# Altium schematic sheet [01] - Shaper Stages.SchDoc
size A4; Address1: III. Physikalisches Institut B; Address2: RWTH Aachen University; Address3: Otto-Blumenthal-Strasse; Address4: 52074 Aachen, GERMANY; DocumentNumber: 2; SheetNumber: 2; SheetTotal: 6
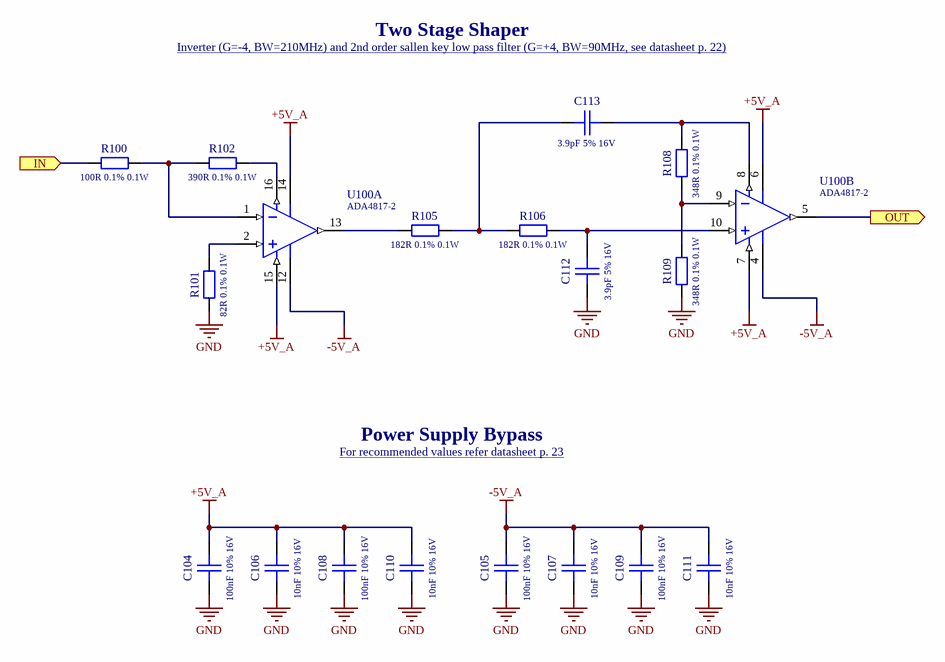
[diagram p0: [01] - Shaper Stages.SchDoc]

## Parts
C104  100nF 10% 16V  [0603_CAP]
C105  100nF 10% 16V  [0603_CAP]
C106  10nF 10% 16V  [0603_CAP]
C107  10nF 10% 16V  [0603_CAP]
C108  100nF 10% 16V  [0603_CAP]
C109  100nF 10% 16V  [0603_CAP]
C110  10nF 10% 16V  [0603_CAP]
C111  10nF 10% 16V  [0603_CAP]
C112  3.9pF 5% 16V  [0603_CAP]
C113  3.9pF 5% 16V  [0603_CAP]
R100  100R 0.1% 0.1W  [0603_RES]
R101  82R 0.1% 0.1W  [0603_RES]
R102  390R 0.1% 0.1W  [0603_RES]
R105  182R 0.1% 0.1W  [0603_RES]
R106  182R 0.1% 0.1W  [0603_RES]
R108  348R 0.1% 0.1W  [0603_RES]
R109  348R 0.1% 0.1W  [0603_RES]
U100  ADA4817-2  [LFCSP-16]  (parts A,B of 2)

## Ports
IN (in), OUT (out)

## Nets
+5V_A: C104.2 C106.2 C108.2 C110.2 U100.6(#VS2) U100.7(~{PD2}) U100.14(VS+) U100.15(~{PD})
-5V_A: C105.2 C107.2 C109.2 C111.2 U100.4(-VS2) U100.12(-VS1)
GND: C104.1 C105.1 C106.1 C107.1 C108.1 C109.1 C110.1 C111.1 C112.1 R101.2 R109.2
IN: R100.2 ; port IN
OUT: U100.5(OUT2) ; port OUT
NetC112_2: C112.2 R106.1 U100.10(IN2+)
NetC113_1: C113.1 R105.1 R106.2
NetC113_2: C113.2 R108.1 U100.8(FB2)
NetR100_1: R100.1 R102.2 U100.1(IN1-)
NetR101_1: R101.1 U100.2(IN2+)
NetR102_1: R102.1 U100.16(FB1)
NetR105_2: R105.2 U100.13(OUT1)
NetR108_2: R108.2 R109.1 U100.9(IN2-)

## Notes on the sheet
- Two Stage Shaper
- Inverter (G=-4, BW=210MHz) and 2nd order sallen key low pass filter (G=+4, BW=90MHz, see datasheet p. 22) <https://www.analog.com/media/en/technical-documentation/data-sheets/ADA4817-1_4817-2.pdf>
- Power Supply Bypass
- For recommended values refer datasheet p. 23 <https://www.analog.com/media/en/technical-documentation/data-sheets/ADA4817-1_4817-2.pdf>
- TITLE
- REVISION
- PROJECT
- AUTHOR
- DESC.
- DATE
- SHEET
- OF

## Library data of the parts
C104-C113 = Capacitor: Simple generic capacitor.; PackageReference: 0603
  C104 C105 C108 C109: Value: 100nF 10% 16V
  C106 C107 C110 C111: Value: 10nF 10% 16V
  C112 C113: Value: 3.9pF 5% 16V
R100-R102 R105 R106 R108 R109 = Resistor: Simple generic resistor.; PackageReference: 0603
  R100: Value: 100R 0.1% 0.1W
  R101: Value: 82R 0.1% 0.1W
  R102: Value: 390R 0.1% 0.1W
  R105 R106: Value: 182R 0.1% 0.1W
  R108 R109: Value: 348R 0.1% 0.1W
U100 = ADA4817-2: Low Noise, 1 GHz FastFET Op Amps; Manufacturer: Analog Devices; PartNumber: LMV358QDGKR; PackageReference: LFCSP-16; Supplier1: RS-Components; Supplier1PartNumber: 764-8781; Supplier1Link: https://de.rs-online.com/web/p/operationsverstarker/7648781/; Value: ADA4817-2